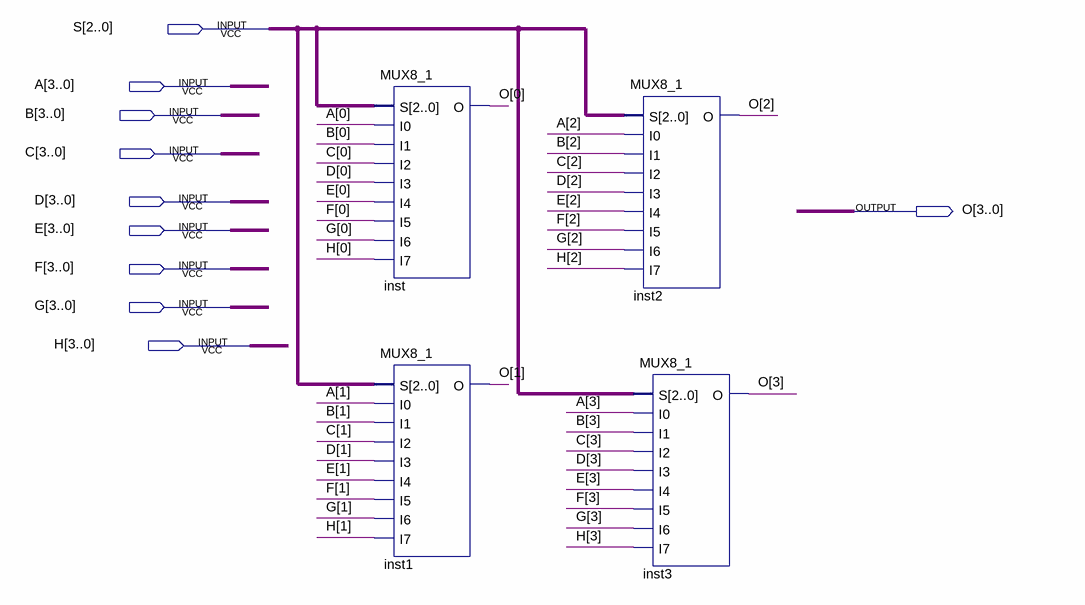
[diagram p0: schematic sheet]
// Quartus schematic 4BIT_MUX8_1.bdf as structural Verilog: 4 symbols, 10 pins
module \4BIT_MUX8_1  (
  input  [2:0] S,
  input  [3:0] A,
  input  [3:0] B,
  input  [3:0] C,
  input  [3:0] D,
  input  [3:0] E,
  input  [3:0] F,
  input  [3:0] G,
  input  [3:0] H,
  output [3:0] O
);

  MUX8_1 inst (.S(S), .I0(A[0]), .I1(B[0]), .I2(C[0]), .I3(D[0]), .I4(E[0]), .I5(F[0]), .I6(G[0]), .I7(H[0]), .O(O[0]));
  MUX8_1 inst1 (
    .S(S), .I0(A[1]), .I1(B[1]), .I2(C[1]), .I3(D[1]), .I4(E[1]), .I5(F[1]), .I6(G[1]), .I7(H[1]), .O(O[1]));
  MUX8_1 inst2 (
    .S(S), .I0(A[2]), .I1(B[2]), .I2(C[2]), .I3(D[2]), .I4(E[2]), .I5(F[2]), .I6(G[2]), .I7(H[2]), .O(O[2]));
  MUX8_1 inst3 (
    .S(S), .I0(A[3]), .I1(B[3]), .I2(C[3]), .I3(D[3]), .I4(E[3]), .I5(F[3]), .I6(G[3]), .I7(H[3]), .O(O[3]));
endmodule
